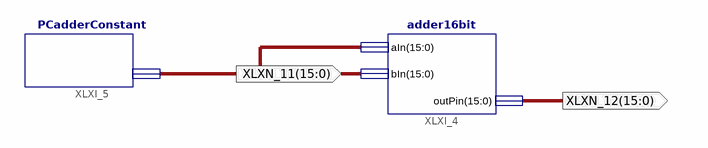
[diagram p0: schematic sheet 1]
// Xilinx ISE schematic PCAdder_Schematic.sch (spartan3e) as structural Verilog: 2 symbols, 2 ports
module PCAdder_Schematic (
  input  [15:0] XLXN_11,
  output [15:0] XLXN_12
);

  wire [15:0] XLXN_10;

  PCadderConstant XLXI_5 (.constantOne(XLXN_10));
  adder16bit XLXI_4 (.aIn(XLXN_10), .bIn(XLXN_11), .outPin(XLXN_12));
endmodule
